# Altium project PCB_Robot_Sumo_2024.PrjPcb
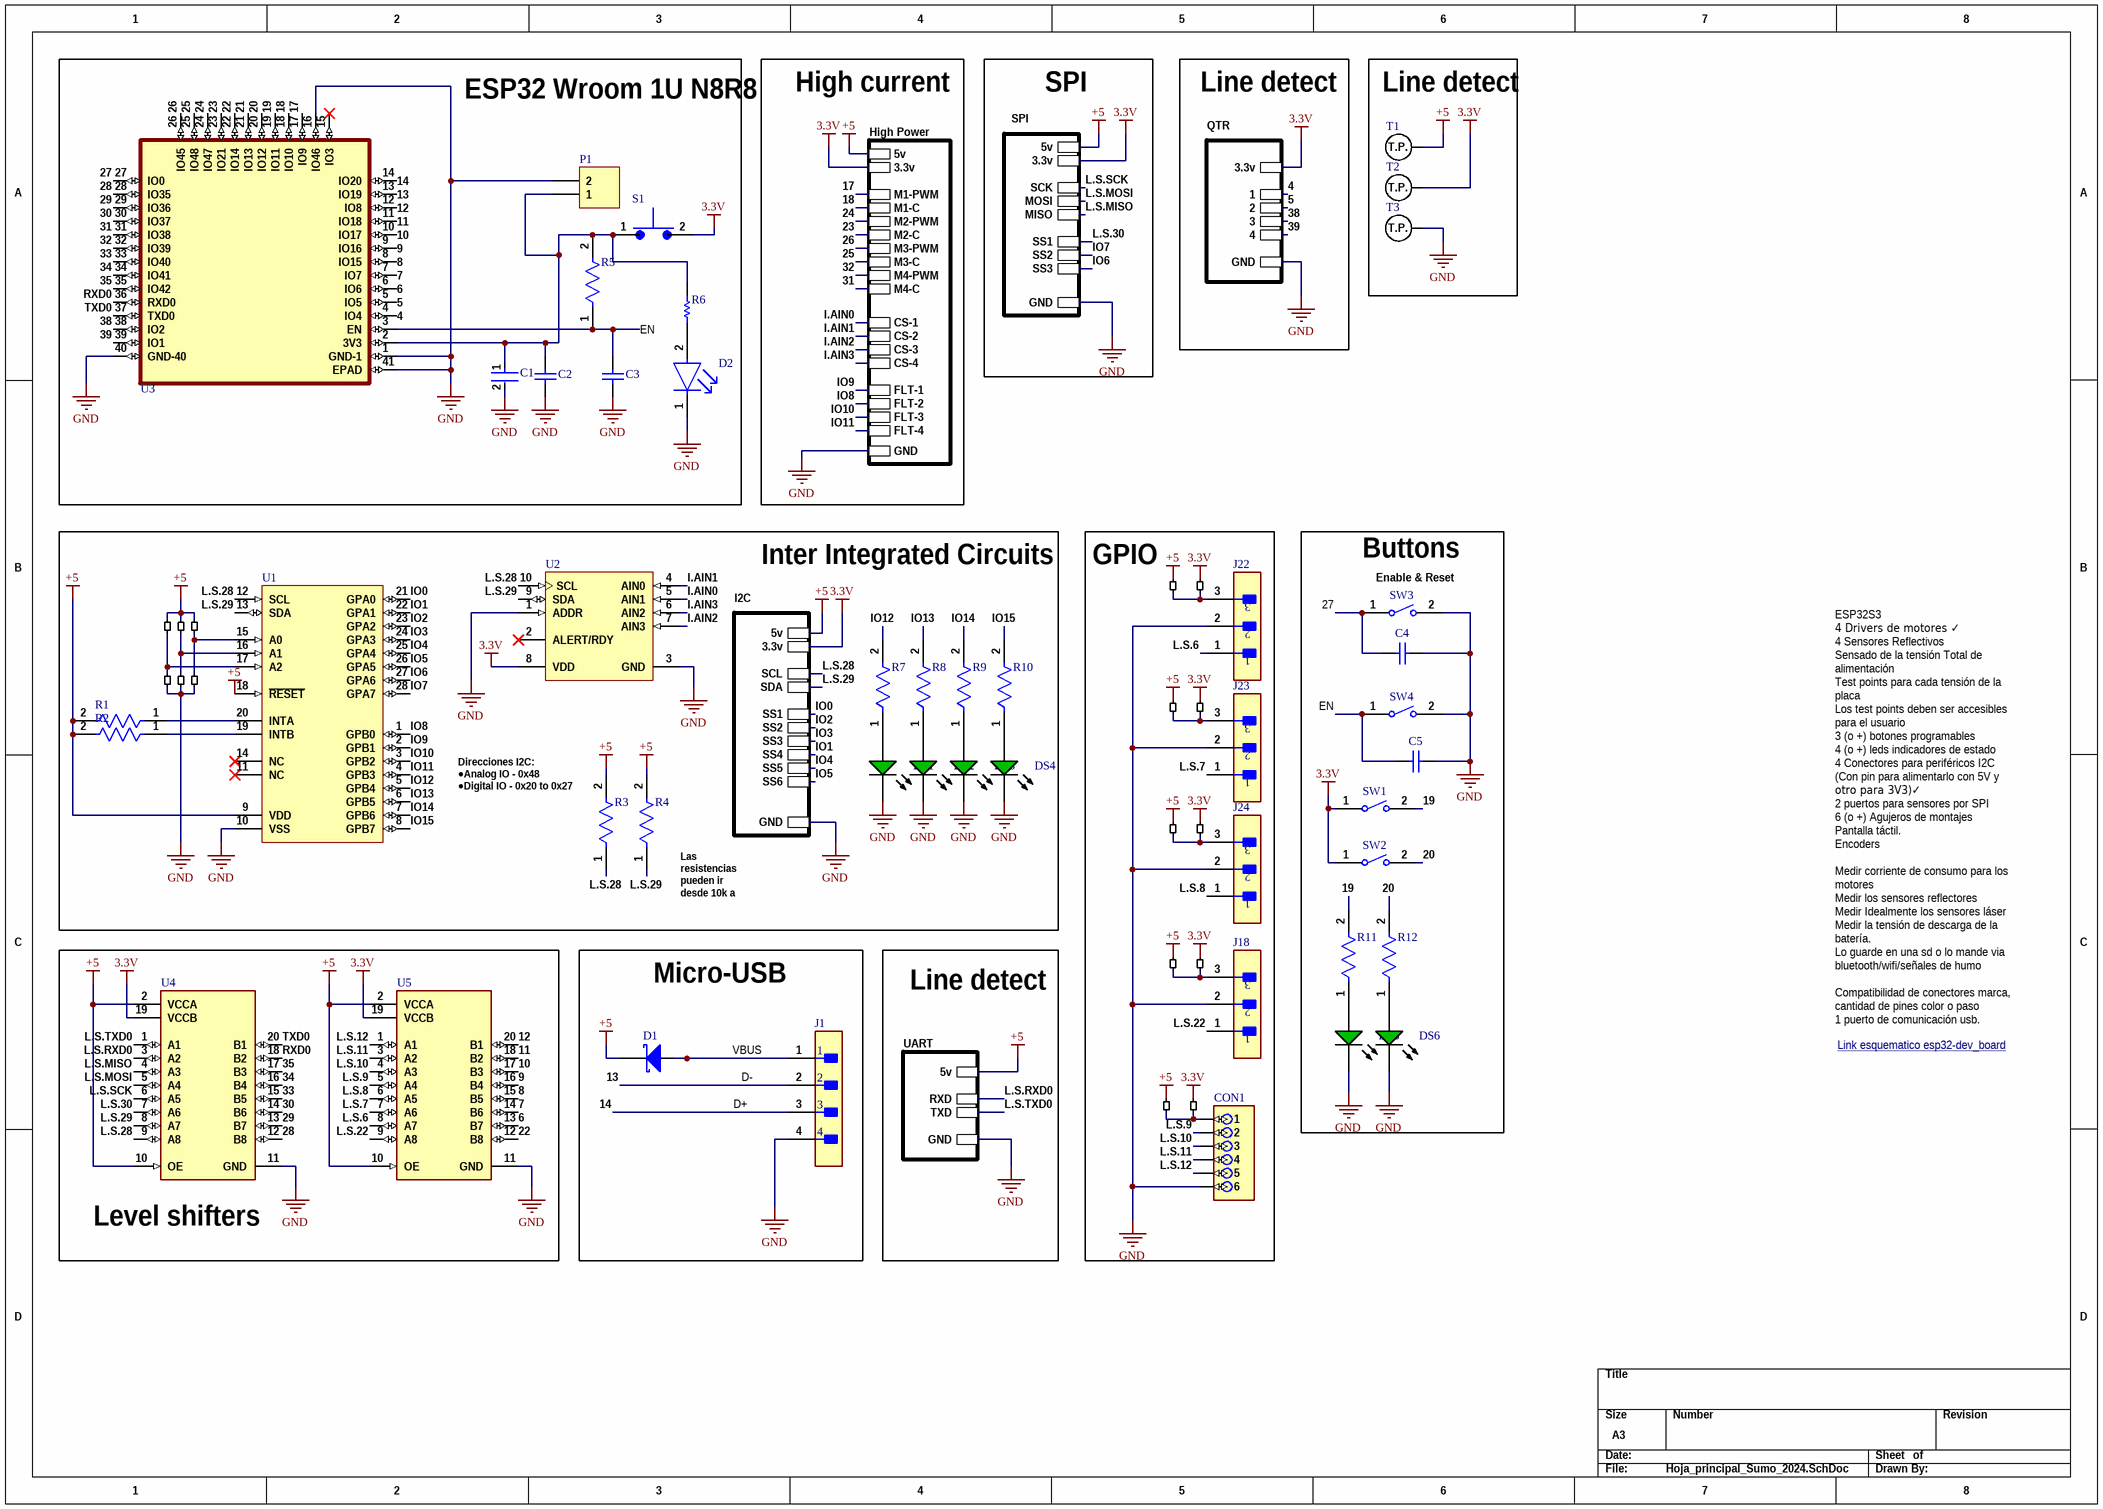
[diagram p0: Hoja_principal_Sumo_2024.SchDoc]
6 sheets, 144 parts. Net scope: hierarchical (ports join the sheet entries above them; power ports are global).
Board file: Brushed_PCB.PcbDoc
Sheets:
  Hoja_principal_Sumo_2024.SchDoc
    I2C = I2C.SchDoc
    QTR = QTR.SchDoc
    SPI = SPI.SchDoc
    UART = UART.SchDoc
    High Power = High_Power.SchDoc

## Sheet Hoja_principal_Sumo_2024.SchDoc: Esquematico Robot Sumo 2024
size A3

### Parts
C1  TMK212BBJ106KG-T  [FP-0805-L_2_0_0_2-W_1_25-MFG]  (value not drawn)
C2  GRM21BR71H104KA01L  [CAPC2013X135X45ML10T25]  (value not drawn)
C3  C0805C105K4PACTU  [CAPC2013X145X50LL20T25]  (value not drawn)
C4  GRM21BR71H104KA01L  [CAPC2013X135X45ML10T25]  (value not drawn)
C5  GRM21BR71H104KA01L  [CAPC2013X135X45ML10T25]  (value not drawn)
CON1  B6B-ZR  [B6B-ZR]  (value not drawn)
D1  BAS3010A03WE6327HTSA1  [INF-SOD323_V]  (value not drawn)
D2  APHCM2012SYCK-F01  [FP-APHCM2012SYCK-F01-MFG]  (value not drawn)
DS1  HSMG-C170  [AVAG-HSMX-C170_V]  (value not drawn)
DS2  HSMG-C170  [AVAG-HSMX-C170_V]  (value not drawn)
DS3  HSMG-C170  [AVAG-HSMX-C170_V]  (value not drawn)
DS4  HSMG-C170  [AVAG-HSMX-C170_V]  (value not drawn)
DS5  HSMG-C170  [AVAG-HSMX-C170_V]  (value not drawn)
DS6  HSMG-C170  [AVAG-HSMX-C170_V]  (value not drawn)
J1  B4B-ZR(LF)(SN)  [FP-B4B-ZR_LF_SN-MFG]  (value not drawn)
J18  B3B-ZR(LF)(SN)  [FP-B3B-ZR_LF_SN-MFG]  (value not drawn)
J22  B3B-ZR(LF)(SN)  [FP-B3B-ZR_LF_SN-MFG]  (value not drawn)
J23  B3B-ZR(LF)(SN)  [FP-B3B-ZR_LF_SN-MFG]  (value not drawn)
J24  B3B-ZR(LF)(SN)  [FP-B3B-ZR_LF_SN-MFG]  (value not drawn)
P1  Header 2  [HDR1X2]  (value not drawn)
R1  CRCW080510K0FKEA  [FP-CRCW0805-e3-IPC_A]  (value not drawn)
R2  CRCW080510K0FKEA  [FP-CRCW0805-e3-IPC_A]  (value not drawn)
R3  CRCW080510K0FKEA  [FP-CRCW0805-e3-IPC_A]  (value not drawn)
R4  CRCW080510K0FKEA  [FP-CRCW0805-e3-IPC_A]  (value not drawn)
R5  CRCW080510K0FKEA  [FP-CRCW0805-e3-IPC_A]  (value not drawn)
R6  CRCW0805680RFKEA  [RESC2013X50X30NL20T20]  (value not drawn)
R7  CRCW0805390RFKEA  [FP-CRCW0805-e3-IPC_B]  (value not drawn)
R8  CRCW0805390RFKEA  [FP-CRCW0805-e3-IPC_B]  (value not drawn)
R9  CRCW0805390RFKEA  [FP-CRCW0805-e3-IPC_B]  (value not drawn)
R10  CRCW0805390RFKEA  [FP-CRCW0805-e3-IPC_B]  (value not drawn)
R11  CRCW0805390RFKEA  [FP-CRCW0805-e3-IPC_B]  (value not drawn)
R12  CRCW0805390RFKEA  [FP-CRCW0805-e3-IPC_B]  (value not drawn)
S1  TS10-63-26-BE-250-SMT-TR  [Switch SMD]  (value not drawn)
SW1  FSMSMTR  [TECO-FSMSMTR_V]  (value not drawn)
SW2  FSMSMTR  [TECO-FSMSMTR_V]  (value not drawn)
SW3  FSMSMTR  [TECO-FSMSMTR_V]  (value not drawn)
SW4  FSMSMTR  [TECO-FSMSMTR_V]  (value not drawn)
T1  Test point  [Testpoint]  (value not drawn)
T2  Test point  [Testpoint]  (value not drawn)
T3  Test point  [Testpoint]  (value not drawn)
U1  MCP23017-E/SS  [SSOP-SS28_L]  (value not drawn)
U2  ADS1115IDGST  [TI-DGS10_N]  (value not drawn)
U3  ESP32-S3-WROOM-1 N8R8  [PCBComponent_1]  (value not drawn)
U4  TXS0108EQPWRQ1  [FP-PW0020A-MFG]  (value not drawn)
U5  TXS0108EQPWRQ1  [FP-PW0020A-MFG]  (value not drawn)
W1  Jumper  [Jumper Mini]  (value not drawn)
W2  Jumper  [Jumper Mini]  (value not drawn)
W3  Jumper  [Jumper Mini]  (value not drawn)
W4  Jumper  [Jumper Mini]  (value not drawn)
W5  Jumper  [Jumper Mini]  (value not drawn)
W6  Jumper  [Jumper Mini]  (value not drawn)
W7  Jumper  [Jumper Mid]  (value not drawn)
W8  Jumper  [Jumper Mid]  (value not drawn)
W9  Jumper  [Jumper Mid]  (value not drawn)
W10  Jumper  [Jumper Mid]  (value not drawn)
W11  Jumper  [Jumper Mid]  (value not drawn)
W12  Jumper  [Jumper Mid]  (value not drawn)
W13  Jumper  [Jumper Mid]  (value not drawn)
W14  Jumper  [Jumper Mid]  (value not drawn)
W27  Jumper  [Jumper Mid]  (value not drawn)
W28  Jumper  [Jumper Mid]  (value not drawn)

### Blocks framed on the sheet
ESP32 Wroom 1U N8R8: C1-C3 D2 P1 R5 R6 S1 U3
Line detect: T1-T3
Inter Integrated Circuits: DS1-DS4 R1-R4 R7-R10 U1 U2 W1-W6
GPIO: CON1 J18 J22-J24 W7-W14 W27 W28
Buttons: C4 C5 DS5 DS6 R11 R12 SW1-SW4
Level shifters: U4 U5
Micro-USB: D1 J1

### Sub-sheets
High Power = High_Power.SchDoc: GND, M1-PWM, M1-C, M2-PWM, M2-C, M3-PWM, M3-C, M4-PWM, M4-C, CS-1, CS-2, CS-3, CS-4, FLT-1, FLT-2, FLT-3, FLT-4, 3.3v, 5v
I2C = I2C.SchDoc: 5v, 3.3v, GND, SCL, SDA, SS1, SS2, SS3, SS4, SS5, SS6
QTR = QTR.SchDoc: 3.3v, GND, 1, 2, 3, 4
SPI = SPI.SchDoc: 5v, 3.3v, GND, MOSI, MISO, SS1, SS2, SS3, SCK
UART = UART.SchDoc: 5v, GND, RXD, TXD

### Nets
3.3V: S1.2 SW1.1 SW2.1 T2.1(T.P.) U2.8(VDD) U4.19(VCCB) U5.19(VCCB) W11.2 W12.2 W13.2 W14.2 W28.2 ; sheet I2C/3.3v, sheet QTR/3.3v, sheet SPI/3.3v, sheet High Power/3.3v
+5: D1.1(K) R1.2 R2.2 R3.2 R4.2 T1.1(T.P.) U1.9(VDD) U1.18(~{RESET}) U4.2(VCCA) U4.10(OE) U5.2(VCCA) U5.10(OE) W1.2 W3.2 W5.2 W7.2 W8.2 W9.2 W10.2 W27.2 ; sheet I2C/5v, sheet SPI/5v, sheet UART/5v, sheet High Power/5v
GND: C1.2 C2.2 C3.1 C4.1 C5.1 CON1.6 D2.1(C) DS1.2(K) DS2.2(K) DS3.2(K) DS4.2(K) DS5.2(K) DS6.2(K) J1.4 J18.2 J22.2 J23.2 J24.2 P1.2 SW3.2 SW4.2 T3.1(T.P.) U1.10(VSS) U2.1(ADDR) U2.3(GND) U3.1(GND-1) U3.16(IO46) U3.40(GND-40) U3.41(EPAD) U4.11(GND) U5.11(GND) W2.1 W4.1 W6.1 ; sheet I2C/GND, sheet QTR/GND, sheet SPI/GND, sheet UART/GND, sheet High Power/GND
4: U3.4(IO4) ; sheet QTR/1
5: U3.5(IO5) ; sheet QTR/2
6: U3.6(IO6) U5.13(B7)
7: U3.7(IO7) U5.14(B6)
8: U3.8(IO15) U5.15(B5)
9: U3.9(IO16) U5.16(B4)
10: U3.10(IO17) U5.17(B3)
11: U3.11(IO18) U5.18(B2)
12: U3.12(IO8) U5.20(B1)
13: J1.2 U3.13(IO19)  [also labelled D-]
14: J1.3 U3.14(IO20)  [also labelled D+]
17: U3.17(IO9) ; sheet High Power/M1-PWM
18: U3.18(IO10) ; sheet High Power/M1-C
19: R11.2 SW1.2 U3.19(IO11)
20: R12.2 SW2.2 U3.20(IO12)
21: U3.21(IO13)
22: U3.22(IO14) U5.12(B8)
23: U3.23(IO21) ; sheet High Power/M2-C
24: U3.24(IO47) ; sheet High Power/M2-PWM
25: U3.25(IO48) ; sheet High Power/M3-C
26: U3.26(IO45) ; sheet High Power/M3-PWM
27: C4.2 SW3.1 U3.27(IO0)
28: U3.28(IO35) U4.12(B8)
29: U3.29(IO36) U4.13(B7)
30: U3.30(IO37) U4.14(B6)
31: U3.31(IO38) ; sheet High Power/M4-C
32: U3.32(IO39) ; sheet High Power/M4-PWM
33: U3.33(IO40) U4.15(B5)
34: U3.34(IO41) U4.16(B4)
35: U3.35(IO42) U4.17(B3)
38: U3.38(IO2) ; sheet QTR/3
39: U3.39(IO1) ; sheet QTR/4
EN: C3.2 C5.2 R5.1 SW4.1 U3.3(EN)
I.AIN0: U2.5(AIN1) ; sheet High Power/CS-1
I.AIN1: U2.4(AIN0) ; sheet High Power/CS-2
I.AIN2: U2.7(AIN3) ; sheet High Power/CS-3
I.AIN3: U2.6(AIN2) ; sheet High Power/CS-4
IO0: U1.21(GPA0) ; sheet I2C/SS1
IO1: U1.22(GPA1) ; sheet I2C/SS4
IO2: U1.23(GPA2) ; sheet I2C/SS2
IO3: U1.24(GPA3) ; sheet I2C/SS3
IO4: U1.25(GPA4) ; sheet I2C/SS5
IO5: U1.26(GPA5) ; sheet I2C/SS6
IO6: U1.27(GPA6) ; sheet SPI/SS3
IO7: U1.28(GPA7) ; sheet SPI/SS2
IO8: U1.1(GPB0) ; sheet High Power/FLT-2
IO9: U1.2(GPB1) ; sheet High Power/FLT-1
IO10: U1.3(GPB2) ; sheet High Power/FLT-3
IO11: U1.4(GPB3) ; sheet High Power/FLT-4
IO12: R7.2 U1.5(GPB4)
IO13: R8.2 U1.6(GPB5)
IO14: R9.2 U1.7(GPB6)
IO15: R10.2 U1.8(GPB7)
L.S.6: J22.1 U5.8(A7)
L.S.7: J23.1 U5.7(A6)
L.S.8: J24.1 U5.6(A5)
L.S.9: CON1.2 U5.5(A4)
L.S.10: CON1.3 U5.4(A3)
L.S.11: CON1.4 U5.3(A2)
L.S.12: CON1.5 U5.1(A1)
L.S.22: J18.1 U5.9(A8)
L.S.28: R3.1 U1.12(SCL) U2.10(SCL) U4.9(A8) ; sheet I2C/SCL
L.S.29: R4.1 U1.13(SDA) U2.9(SDA) U4.8(A7) ; sheet I2C/SDA
L.S.30: U4.7(A6) ; sheet SPI/SS1
L.S.MISO: U4.4(A3) ; sheet SPI/MISO
L.S.MOSI: U4.5(A4) ; sheet SPI/MOSI
L.S.RXD0: U4.3(A2) ; sheet UART/RXD
L.S.SCK: U4.6(A5) ; sheet SPI/SCK
L.S.TXD0: U4.1(A1) ; sheet UART/TXD
RXD0: U3.36(RXD0) U4.18(B2)
TXD0: U3.37(TXD0) U4.20(B1)
VBUS: D1.2(A) J1.1
NetC1_1: C1.1 C2.1 P1.1 R5.2 R6.2 S1.1 U3.2(3V3)
NetCON1_1: CON1.1 W7.1 W11.1
NetD2_2: D2.2(A) R6.1
NetDS1_1: DS1.1(A) R7.1
NetDS2_1: DS2.1(A) R8.1
NetDS3_1: DS3.1(A) R9.1
NetDS4_1: DS4.1(A) R10.1
NetDS5_1: DS5.1(A) R11.1
NetDS6_1: DS6.1(A) R12.1
NetJ18_3: J18.3 W27.1 W28.1
NetJ22_3: J22.3 W8.1 W12.1
NetJ23_3: J23.3 W9.1 W13.1
NetJ24_3: J24.3 W10.1 W14.1
NetR1_1: R1.1 U1.20(INTA)
NetR2_1: R2.1 U1.19(INTB)
NetU1_15: U1.15(A0) W5.1 W6.2
NetU1_16: U1.16(A1) W3.1 W4.2
NetU1_17: U1.17(A2) W1.1 W2.2

Not connected (* = marked no-connect by the designer): U1 11(NC)* 14(NC)*; U2 2(ALERT/RDY)*; U3 15(IO3)*

### Notes on the sheet
- High current
- SPI
- Line detect
- (near SW3) Enable & Reset
- (near R3) Direcciones I2C:
  ●Analog IO - 0x48
  ●Digital IO - 0x20 to 0x27
- (near R4) Las resistencias pueden ir desde 10k a 4k7
- ESP32S3
  4 Drivers de motores ✓
  4 Sensores Reflectivos
  Sensado de la tensión Total de alimentación
  Test points para cada tensión de la placa
  Los test points deben ser accesibles para el usuario
  3 (o +) botones programables
  4 (o +) leds indicadores de estado
  4 Conectores para periféricos I2C (Con pin para alimentarlo con 5V y otro para 3V3)✓
  2 puertos para sensores por SPI
  6 (o +) Agujeros de montajes
  Pantalla táctil.
  Encoders
  Medir corriente de consumo para los motores
  Medir los sensores reflectores
  Medir Idealmente los sensores láser
  Medir la tensión de descarga de la batería.
  Lo guarde en una sd o lo mande via bluetooth/wifi/señales de humo
  Compatibilidad de conectores marca, cantidad de pines color o paso
  1 puerto de comunicación usb.
- Link esquematico esp32-dev_board <https://dl.espressif.com/dl/schematics/SCH_ESP32-S3-DevKitC-1_V1.1_20220413.pdf>

### Library data of the parts
C1 = CMP-14477-000079-3: Multilayer Ceramic Capacitor 10uF 25V X5R 10% SMD 0805 T/R; Voltage: 16V; Dielectric: X7R; Number of Pins: 2; Width: 0.049inch; REACH SVHC: No SVHC; Packaging: Tape and Reel; Max Operating Temperature: 85°C; Length: 0.079inch; Termination: SMD/SMT; RoHS Compliant: Yes; Thickness: 0.053inch; Case/Package: 0805; Case Code (Imperial): 0805; Capacitance: 10uF; Lead Free: Lead Free; Voltage Rating: 25V; Resistor Type: Ceramic; Voltage Rating (DC): 25V; Case Code (Metric): 2012; Mount: Surface Mount; Package Quantity: 1; Height: 1.25mm; Series: M; Tolerance: 10%; Min Operating Temperature: -55°C
C2 C4 C5 = CMP-2100-03644-1: Chip Capacitor, 0.1 uF, +/- 10%, 50 V, -55 to 125 degC, 0805 (2012 Metric), RoHS, Tape and Reel; Manufacturer: Murata; Voltage: 50V; Capacitance: 100nF; Insulation Resistance: 10GR; Dielectric Material: Ceramic; Dielectric: X7R; Package Description: 2-Pin Surface Mount Device, Body 2 x 1.25 mm; Manufacturer URL: http://www.murata.com/; Case Code (Imperial): 0805; Datasheet URL: http://psearch.en.murata.com/capacitor/product/GRM21BR71H104KA01%23.pdf; Termination: SMD/SMT; Lead Free: LeadFree; Package Quantity: 1; Mount: SurfaceMount; REACH SVHC: Unknown; Thickness: 0.053inch; Height: 1.25mm; Case/Package: 0805; Voltage Rating: 50V; Width: 0.049inch; Case Code (Metric): 2012; Material: Ceramic; Min Operating Temperature: -55degC; RoHSCompliant: true; Datasheet Version: 42675.0; Voltage Rating (DC): 50V; Tolerance: 10%; Package Reference: 0805; Depth: 1.25mm; Length: 2mm; Max Operating Temperature: 125degC; Packaging: TapeandReel; Number of Pins: 2; Radiation Hardening: No
C3 = CMP-1036-04746-2: Manufacturer: Kemet; Part Number: C0805C105K4PACTU
CON1 = B6B-ZR: Connector Header Surface Mount 6 position 0.059 (1.50mm); MF: JST; Package: None; MP: B6B-ZR; Price: None; Availability: Unavailable; Check_prices: https://www.snapeda.com/parts/B6B-ZR/JST/view-part/4701794/?ref=eda; Value: *; SnapEDA_Link: https://www.snapeda.com/parts/B6B-ZR/JST/view-part/4701794/?ref=snap
D1 = CMP-2000-05919-1: Medium Power AF Schottky Diode, 0.41 V, 1 A, -65 to 125 degC, 2-Pin SOD323, RoHS, Tape and Reel; Manufacturer: Infineon; Lead Finish: Tin; Peak Average Forward Current: 1A; Peak Reverse Repetitive Voltage: 30V; Max Processing Temp: 260; Configuration: Single; Screening Level: Automotive; Package Reference: SOD323; Package Description: 2-Pin Small Outline Diode Package, Body 1.25 x 1.7 mm; Manufacturer URL: http://www.infineon.com/; Mounting: SurfaceMount; Mounting Technology: SurfaceMount; Datasheet URL: http://www.infineon.com/dgdl/Infineon-BAS3010ASERIES-DS-v01_01-en.pdf?fileId=db3a30431ddc9372011dfbc50f231c06; Type: SchottkyDiode; Datasheet Version: 04/2007; Operating Temperature: -65to125C; Package URL: http://www.infineon.com/dgdl/SOD323-Package_Overview.pdf?folderId=db3a30431936bc4b011952aab84f3bbe&fileId=db3a30431936bc4b011952beed653be3
D2 = CMP-44529-000064-1: LED YELLOW CLEAR CHIP SMD; Number of LEDs: 1; Luminous Intensity: 150mcd; Dominant Wavelength: 590nm; Test Current: 20mA; Illumination Color: Green; Forward Voltage: 2V; Viewing Angle: 110°; Number of Pins: 2; Packaging: Tape and Reel; Width: 1.25mm; Height: 0.4mm; Lens Color: Clear; RoHS Compliant: Yes; Lead Free: Lead Free; Min Operating Temperature: -40°C; Case Code (Imperial): 0805; Case/Package: 0805; Series: APHCM; Wavelength: 590nm; Max Operating Temperature: 85°C; Length: 2mm; Color: Yellow; Package Quantity: 2000; Mount: Surface Mount; Lens Style: Clear; Forward Current: 20mA; Case Code (Metric): 2012
DS1-DS6 = CMP-2000-05062-1: Chip LED, Green, 2.2 V, -40 to 85 degC, 2-Pin SMD, Pb-Free, Tape and Reel; Manufacturer: Avago; No. of Pins: 2; Peak Wavelength: 570nm; SVHC: NoSVHC(16-Jun-2014); Dominant Wavelength: 572nm; Forward Current If: 20mA; Viewing Angle: 170deg; Lens Shape: Rectangular; PIV Max: 5V; External Width: 1.25mm; LED Type: Standard; External Depth: 0.8mm; Opto Mounting Orientation: Top; Luminous Intensity: 15mcd; Luminous Intensity Min: 4mcd; Forward Voltage VF Max: 2.6V; External Length / Height: 2mm; Bulb Size: 1.25mmx1.4mm; Light Area Height: 1mm; Voltage Vf Typ: 2.2V; Operating Temperature Max: 85degC; Datasheet Version: Oct-08; MSL: MSL2A-4weeks; Peak Forward Current: 20mA; Package Description: 2-Pin Surface Mount Device, Body 2 x 1.25 mm, Height 0.8 mm; Datasheet URL: https://datasheet.ciiva.com/29280/180495-da-01-en-chip-led-hsmg-c170-gelb-gruen-29280971.pdf; Storage Temperature Min: -40degC; LED Colour: Green; Wavelength Typ: 570nm; Mounting Type: SMD; Forward Current If Max: 20mA; Dominant Wavelength Typ: 572nm; LED Mounting: SMD; Operating Temperature Range: -30degCto+85degC; Operating Temperature Min: -30degC; Manufacturer URL: http://www.avagotech.com/; Packaging: CutTape; Luminous Intensity Typ: 15mcd; Package Reference: HSMX-C170; Storage Temperature Max: 85degC; Opto Case Style: SMD; Forward Voltage: 2.2V
J1 = CMP-17439-000033-1: CONN HEADER VERT 4POS 1.5MM; Max Current Rating: 1A; Max Voltage Rating (AC): 50V; Contact Resistance: 30mR; Body Plating: Tin; Number of Positions: 4; Connector Type: Male Pin; Panel Thickness: 3.5mm; Gender: Male; Insulation Resistance: 500MR; Termination: Solder; Fastening Type: Detent; Housing Material: Polyamide; Voltage Rating (DC): 50V; REACH SVHC: No SVHC; Lead Free: Lead Free; Min Operating Temperature: -25°C; Depth: 3.5mm; Contact Mating Length: 0.094inch; Material: Nylon; Max Operating Temperature: 85°C; Mount: Through Hole; Number of Rows: 1; Orientation: Straight; Current Rating: 1A; Flammability Rating: UL94 V-0; Housing Color: Beige; Length: 7.5mm; Packaging: Bulk; Voltage Rating: 50V; Voltage Rating (AC): 50V; Number of Contacts: 4; Lead Pitch: 1.5mm; Series: ZH; Color: Natural; Contact Plating: Tin; Pitch: 1.5mm; Contact Type: Male Pin; Contact Material: Brass
J18 J22-J24 = CMP-17439-000041-1: CONN HEADER VERT 3POS 1.5MM; Gender: Male; Max Voltage Rating (AC): 50V; Body Plating: Tin; Panel Thickness: 3.5mm; Number of Contacts: 3; Connector Type: Male Pin; Max Current Rating: 1A; Insulation Resistance: 500MR; Contact Resistance: 30mR; Pitch: 1.5mm; Lead Pitch: 1.5mm; Termination: Solder; Material: Nylon; Depth: 3.5mm; Min Operating Temperature: -25°C; Voltage Rating (DC): 50V; Number of Positions: 3; Voltage Rating (AC): 50V; Contact Plating: Tin; Housing Material: Polyamide; Mount: Through Hole; Number of Rows: 1; Series: ZH; Lead Free: Lead Free; Flammability Rating: UL94 V-0; Housing Color: Beige; REACH SVHC: No SVHC; Current Rating: 1A; Contact Type: Male Pin; Orientation: Straight; Voltage Rating: 50V; Packaging: Bulk; Color: Natural; Length: 6mm; Contact Material: Copper; Max Operating Temperature: 85°C; Fastening Type: Detent; Contact Mating Length: 0.094inch
P1 = Header 2: Header, 2-Pin; LatestRevisionDate: 17-Jul-2002; LatestRevisionNote: Re-released for DXP Platform.; Publisher: Altium Limited
R1-R5 = CMP-2001-04908-2: RES Thick Film, 10kΩ, 1%, 0.125W, 100ppm/°C, 0805; Resistance: 10kR; Voltage Rating (DC): 150V; Power Rating: 125mW; Weight: 0.000194oz; Package Quantity: 5000; Military Standard: Not; Max Operating Temperature: 155°C; Temperature Coefficient: 100ppm/°C; Contact Plating: Tin; Width: 1.25mm; Height: 0.45mm; Radiation Hardening: No; Tolerance: 1%; Min Operating Temperature: -55°C; Voltage Rating: 150V; Length: 2mm; Depth: 1.25mm; Termination: SMD/SMT; Packaging: Tape and Reel; Case/Package: 0805; Case Code (Metric): 2012; Lead Free: Lead Free; Case Code (Imperial): 0805; Composition: Thick Film
R6 = CMP-2001-04066-1: Manufacturer: Vishay Dale; Part Number: CRCW0805680RFKEA
R7-R12 = CMP-2001-03859-2: RES Thick Film, 390Ω, 1%, 0.125W, 100ppm/°C, 0805; Power Rating: 125mW; Voltage Rating: 150V; Resistance: 390R; Temperature Coefficient: 100ppm/°C; Max Operating Temperature: 155°C; Case Code (Imperial): 0805; Package Quantity: 10; Case Code (Metric): 2012; Weight: 0.000194oz; Case/Package: 0805; Depth: 1.25mm; Tolerance: 1%; Number of Terminations: 2; Min Operating Temperature: -55°C; Composition: Thick Film; Packaging: Tape and Reel; Features: Automotive AEC-Q200; Contact Plating: Tin; Radiation Hardening: No; Mount: Surface Mount; Length: 2mm; Military Standard: Not; Voltage Rating (DC): 150V; Termination: SMD/SMT; Max Power Dissipation: 125mW; Width: 0.049inch; Lead Free: Lead Free; Height: 0.45mm
SW1-SW4 = CMP-2000-07501-1: FSMSM Push Button Switch, 50 mA, -35 to 85 degC, 2-Pin SMD, RoHS, Tape and Reel; Manufacturer: TE Connectivity; Voltage Rating (DC): 24V; Electrical Life: 20000Cycles; Operating Force: 180gf; Switch Travel: 0.25mm; Contact Current Rating: 50mA; Case\/Package: SMD/SMT; Actuator Length: 1.07mm; Throw Configuration: SPST; Actuator Material: Polyamide; Contact Resistance: 100mOhm; Illumination Type: Illuminated; Max Voltage Rating (DC): 12V; Manufacturer URL: http://www.te.com/; Lead Free: LeadFree; Packaging: TapeandReel; Min Operating Temperature: -35degC; Mechanical Life: 20000Cycles; Mount: SurfaceMount; REACH SVHC: Unknown; Package Quantity: 1800; Package Reference: FSMSMTR; RoHSCompliant: true; Max Operating Temperature: 85degC; Orientation: Straight; ELV: Compliant; Datasheet URL: http://www.te.com/commerce/DocumentDelivery/DDEController?Action=showdoc&DocId=Customer+Drawing%7F1437566-3%7FC2%7Fpdf%7FEnglish%7FENG_CD_1437566-3_C2_1437566_3_1_c.dwg.pdf%7F1437566-4; Package Description: 2-Pin Surface Mount Device, Body 6 x 3.5 mm, Pitch 9.19 mm; Current Rating: 50mA; Contact Plating: Silver; Termination: GullWing; Datasheet Version: Rev. C2, 08/2014; Contact Material: Brass; Mounting Technology: SurfaceMount
U1 = CMP-0186-00176-2: 16-Bit I/O Expander with Serial Interface, 28-Pin SSOP, Extended Temperature; PackageVersion: revBB, Aug-2009; ComponentLink1Description: Manufacturer URL; ComponentLink3Description: Package Specification; PackageDescription: 28-Lead Plastic Shrink Small Outline (SS) - 5.3mm Body [SSOP]; ComponentLink1URL: http://www.microchip.com/; Code_JEDEC: MS-150; RevisionNote: URLs added.; ComponentLink3URL: http://www.microchip.com/stellent/groups/techpub_sg/documents/packagingspec/en012702.pdf; ComponentLink2URL: http://ww1.microchip.com/downloads/en/DeviceDoc/21952b.pdf; ComponentLink2Description: Datasheet; PackageReference: SSOP-SS28; DatasheetVersion: revB, Feb-2007
U2 = CMP-0003-00378-2: 16-Bit ADC with Integrated Multiplexer, PGA, Comparator, Oscillator, and Reference, -40 to 125 degC, 10-pin SOP (DGS10), Green (RoHS & no Sb/Br); Manufacturer: Texas Instruments; Sample Rate (max)(SPS): 860; SubFamily: Precision ADC (<=10MSPS); Architecture: Delta-Sigma; Digital Supply(Min)(V): 2; Resolution(Bits): 16; Digital Supply(Max)(V): 5.5; INL(Max)(+/-LSB): 1; Interface: Serial I2C; # Input Channels: 4; Eco-Plan: Green (RoHS & no Sb/Br); PackageDescription: 10-Pin Plastic Small Outline, Body 3 x 3 mm, Pitch 0.5 mm; Mounting Technology: Surface Mount; PackageReference: DGS10; DatasheetVersion: SBAS444B; ComponentLink3Description: Package Specification; ComponentLink1Description: Manufacturer URL; PartNumber: ADS1115IDGST; ComponentLink3URL: http://www.ti.com/lit/ml/mpds035b/mpds035b.pdf; ComponentLink2URL: http://www.ti.com/general/docs/lit/getliterature.tsp?genericPartNumber=ADS1115&fileType=pdf; Analog Voltage AV/DD(Min)(V): 2; ComponentLink2Description: Datasheet; PackageVersion: 4073272/C, 02/2004; Analog Voltage AV/DD(Max)(V): 5.5; Code_JEDEC: MO-153; ComponentLink1URL: http://www.ti.com/
U3 = ESP32-S3-WROOM-1: SMD MODULE, ESP32-S3R8 WITH 8 MB; MF: Espressif Systems; SnapEDA_Link: https://www.snapeda.com/parts/ESP32-S3-WROOM-1/Espressif+Systems/view-part/?ref=snap; Package: NON STANDARD Espressif Systems; Value: *; MP: ESP32-S3-WROOM-1; Check_prices: https://www.snapeda.com/parts/ESP32-S3-WROOM-1/Espressif+Systems/view-part/?ref=eda; Supplier 1: Digikey
U4 U5 = CMP-04899-000001-1: IC TRNSLTR BIDIRECTIONAL 20TSSOP; Manufacturer: Texas Instruments; Standoff Height: 0.05mm; Number Of Circuits: 1; V A Max: 3.6V; Automotive Grade: Grade 1; Number Of Inputs: 8; Max Junction Temp: +150°C; V A Min: 1.4V; Nominal Supply Current: 8uA; Logic Function Desc: Non-inverting; V B Max: 5.5V; V B Min: 1.65V; Data Rate: 110Mbits/s; Ambient Temperature Range High: +125°C; Height: 1.2mm; Temperature Range High: +125°C; ComponentLink2Description: Datasheet; Manufacturer Part Number: TXS0108EQPWRQ1; Digikey Description: IC TRNSLTR BIDIRECTIONAL 20TSSOP; Lead Free: Yes; Automotive: Yes; Number Of Outputs: 8; Temperature Range Low: -40°C; Mouser Description: Translation - Voltage Levels 8B Bidir Vltg-Level Translator ALT 595-TXS0108EPWR; Ambient Temperature Range Low: -40°C; ComponentLink2URL: http://www.ti.com/lit/ds/symlink/txs0108e-q1.pdf; Device Class L2: Logic ICs; Min Supply Voltage: 1.4V; Device Class L1: Integrated Circuits (ICs); Octopart: https://octopart.com/txs0108eqpwrq1-texas+instruments-59160487; Temperature: -40°C to +125°C; Package: PW0020A; RoHS: TRUE; Ipc Land Pattern Name: SOP65P640X120-20; Device Class L3: Voltage Level Shifters; Max Supply Voltage: 5.5V; Category: IC
S1 = TS10-63-26-BE-250-SMT-TR: Value: *; Package: None; Price: None; MP: TS10-63-26-BE-250-SMT-TR; Availability: Unavailable; Supplier 1: Digikey; Supplier Part Number 1: 2223-TS10-63-26-BE-250-SMT-TRCT-ND

## Sheet I2C.SchDoc
size A4
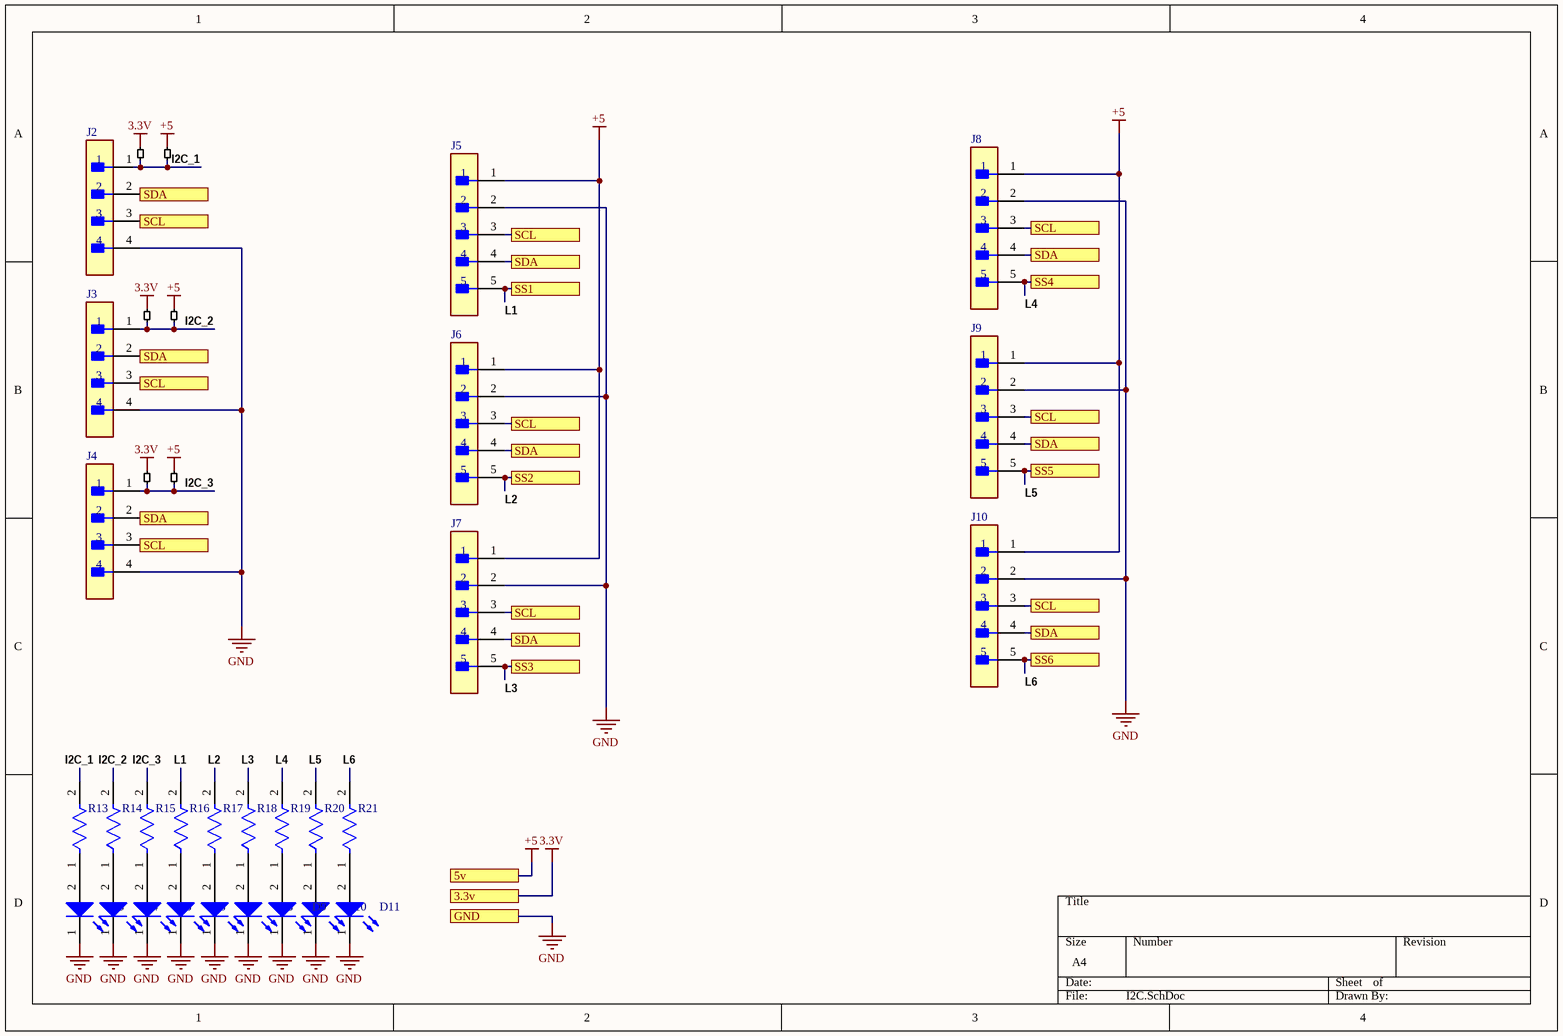
[diagram p1: I2C.SchDoc]

### Parts
D3  150080BS75000  [WL-SMCW_0805_150080xx75000]  (value not drawn)
D4  150080BS75000  [WL-SMCW_0805_150080xx75000]  (value not drawn)
D5  150080BS75000  [WL-SMCW_0805_150080xx75000]  (value not drawn)
D6  150080BS75000  [WL-SMCW_0805_150080xx75000]  (value not drawn)
D7  150080BS75000  [WL-SMCW_0805_150080xx75000]  (value not drawn)
D8  150080BS75000  [WL-SMCW_0805_150080xx75000]  (value not drawn)
D9  150080BS75000  [WL-SMCW_0805_150080xx75000]  (value not drawn)
D10  150080BS75000  [WL-SMCW_0805_150080xx75000]  (value not drawn)
D11  150080BS75000  [WL-SMCW_0805_150080xx75000]  (value not drawn)
J2  B4B-XH-A(LF)(SN)  [FP-B4B-XH-A_LF_SN-MFG]  (value not drawn)
J3  B4B-XH-A(LF)(SN)  [FP-B4B-XH-A_LF_SN-MFG]  (value not drawn)
J4  B4B-XH-A(LF)(SN)  [FP-B4B-XH-A_LF_SN-MFG]  (value not drawn)
J5  B5B-PH-K-S(LF)(SN)  [FP-B5B-PH-K-S_LF_SN-MFG]  (value not drawn)
J6  B5B-PH-K-S(LF)(SN)  [FP-B5B-PH-K-S_LF_SN-MFG]  (value not drawn)
J7  B5B-PH-K-S(LF)(SN)  [FP-B5B-PH-K-S_LF_SN-MFG]  (value not drawn)
J8  B5B-PH-K-S(LF)(SN)  [FP-B5B-PH-K-S_LF_SN-MFG]  (value not drawn)
J9  B5B-PH-K-S(LF)(SN)  [FP-B5B-PH-K-S_LF_SN-MFG]  (value not drawn)
J10  B5B-PH-K-S(LF)(SN)  [FP-B5B-PH-K-S_LF_SN-MFG]  (value not drawn)
R13  ERJ-P06F1001V  [FP-ERJP06-IPC_C]  (value not drawn)
R14  ERJ-P06F1001V  [FP-ERJP06-IPC_C]  (value not drawn)
R15  ERJ-P06F1001V  [FP-ERJP06-IPC_C]  (value not drawn)
R16  ERJ-P06F1001V  [FP-ERJP06-IPC_C]  (value not drawn)
R17  ERJ-P06F1001V  [FP-ERJP06-IPC_C]  (value not drawn)
R18  ERJ-P06F1001V  [FP-ERJP06-IPC_C]  (value not drawn)
R19  ERJ-P06F1001V  [FP-ERJP06-IPC_C]  (value not drawn)
R20  ERJ-P06F1001V  [FP-ERJP06-IPC_C]  (value not drawn)
R21  ERJ-P06F1001V  [FP-ERJP06-IPC_C]  (value not drawn)
W15  Jumper  [Jumper Mid]  (value not drawn)
W16  Jumper  [Jumper Mid]  (value not drawn)
W17  Jumper  [Jumper Mid]  (value not drawn)
W18  Jumper  [Jumper Mid]  (value not drawn)
W19  Jumper  [Jumper Mid]  (value not drawn)
W20  Jumper  [Jumper Mid]  (value not drawn)

### Ports
3.3v, 5v, GND, SCL, SDA, SS1, SS2, SS3, SS4, SS5, SS6

### Nets
3.3V: W15.2 W16.2 W17.2 ; port 3.3v
+5: J5.1 J6.1 J7.1 J8.1 J9.1 J10.1 W18.2 W19.2 W20.2 ; port 5v
GND: D3.1(K) D4.1(K) D5.1(K) D6.1(K) D7.1(K) D8.1(K) D9.1(K) D10.1(K) D11.1(K) J2.4 J3.4 J4.4 J5.2 J6.2 J7.2 J8.2 J9.2 J10.2 ; port GND
I2C_1: J2.1 R13.2 W15.1 W18.1
I2C_2: J3.1 R14.2 W16.1 W19.1
I2C_3: J4.1 R15.2 W17.1 W20.1
L1: J5.5 R16.2 ; port SS1  [project net IO0]
L2: J6.5 R17.2 ; port SS2  [project net IO2]
L3: J7.5 R18.2 ; port SS3  [project net IO3]
L4: J8.5 R19.2 ; port SS4  [project net IO1]
L5: J9.5 R20.2 ; port SS5  [project net IO4]
L6: J10.5 R21.2 ; port SS6  [project net IO5]
L.S.28: J2.3 J3.3 J4.3 J5.3 J6.3 J7.3 J8.3 J9.3 J10.3 ; port SCL
L.S.29: J2.2 J3.2 J4.2 J5.4 J6.4 J7.4 J8.4 J9.4 J10.4 ; port SDA
NetD3_2: D3.2(A) R13.1
NetD4_2: D4.2(A) R14.1
NetD5_2: D5.2(A) R15.1
NetD6_2: D6.2(A) R16.1
NetD7_2: D7.2(A) R17.1
NetD8_2: D8.2(A) R18.1
NetD9_2: D9.2(A) R19.1
NetD10_2: D10.2(A) R20.1
NetD11_2: D11.2(A) R21.1

### Library data of the parts
D3-D11 = CMP-1426-00008-6: NexarPartId: 29717779; Test Current: 20mA; Lens Style: Clear, Rectangular; Forward Current: 100mA; Power Dissipation: 105mW; Dominant Wavelength: 470nm; Reverse Voltage: 5V; Viewing Angle: 140°; Luminous Intensity: 145mcd; Color: Blue; Forward Voltage: 3.2V; Max Junction Temperature (Tj): 95°C; Peak Wavelength: 465nm; Min Operating Temperature: -40°C; Mount: Surface Mount; Case Code (Imperial): 0805; Packaging: Tape and Reel; Lead Free: Lead Free; Length: 2mm; Case/Package: 0805; Case Code (Metric): 2012; Max Operating Temperature: 85°C; Height: 700µm; RoHS: Compliant; Max Reverse Voltage (DC): 5V; REACH SVHC: Unknown; Width: 1.25mm; Wavelength: 470nm
J2-J4 = CMP-17439-000250-1: CONN HEADER VERT 4POS 2.5MM; Number of Contacts: 4; Contact Resistance: 20mR; Voltage Rating: 250V; Max Current Rating: 3A; Gender: Male; Wire/Cable Gauge: 22AWG; Mated Stacking Heights: 9.8mm; Insulation Resistance: 1GR; Orientation: Straight; Contact Type: Male Pin; Contact Finish - Mating: TIN; Series: XH; Max Voltage Rating (AC): 250V; Lead Pitch: 2.5mm; Contact Shape: Square; Insulation Color: Natural; Termination: Solder; Lead Free: Lead Free; Voltage Rating (AC): 250V; Number of Rows: 1; Flammability Rating: UL94 V-0; Number of Positions: 4; Max Operating Temperature: 85°C; Package Quantity: 500; Mount: Through Hole; REACH SVHC: No SVHC; Connector Type: Header; Insulation Material: Nylon; Fastening Type: Detent; Min Operating Temperature: -25°C; Housing Color: White; Packaging: Bulk; Contact Plating: Tin; Contact Material: Brass; Max Voltage Rating (DC): 250V; Housing Material: Polyamide; Color: Natural; Material: Polyamide; Pitch: 2.5mm; Depth: 5.75mm; Current Rating: 3A; Length: 12.4mm
J5-J10 = CMP-2000-05908-2: CONN HEADER VERT 5POS 2MM; Voltage Rating (AC): 100V; Number of Positions: 5; Contact Resistance: 20mR; Insulation Resistance: 1MR; Current Rating: 2A; Gender: Male; Mated Stacking Heights: 8mm; Series: PH; Number of Poles: 5; Width: 4.5mm; Insulation Color: Natural; Fastening Type: Detent; Flammability Rating: UL94 V-0; Mount: Through Hole; Lead Free: Lead Free; Number of Rows: 1; REACH SVHC: No SVHC; Max Voltage Rating (AC): 100V; Contact Mating Length: 0.13inch; Contact Plating: Tin; Housing Material: Polyamide; Depth: 4.5mm; Contact Type: Male Pin; Voltage Rating: 100V; Color: Natural; Housing Color: White; Lead Pitch: 2mm; Number of Contacts: 5; Orientation: Straight; Packaging: Bulk; Contact Material: Brass; Pitch: 2mm; Insulation Material: Nylon; Connector Type: Header; Contact Finish - Mating: TIN; Termination: Solder; Number of Pins: 5; Length: 11.9mm; Contact Shape: Square; Max Current Rating: 2A; Working Voltage: 100V; Min Operating Temperature: -25°C; Max Operating Temperature: 85°C; Material: Polyamide; Height: 9.4mm
R13-R21 = CMP-05422-000125-1: RES SMD 1K OHM 1% 1/2W 0805; Temperature Coefficient: 100ppm/°C; Max Power Dissipation: 500mW; Voltage Rating: 150V; Resistance: 1kR; Case Code (Metric): 2012; Max Operating Temperature: 155°C; REACH SVHC: No SVHC; Mount: Surface Mount; Military Standard: Not; Package Quantity: 5000; Series: ERJ; Height: 0.6mm; Radiation Hardening: No; Termination: Tab; Number of Terminations: 2; Length: 2mm; Resistance Tolerance: 1%; Voltage Rating (DC): 150V; Depth: 1.25mm; Construction: Rectangular; Resistor Type: Thick Film; Packaging: Tape and Reel; Contact Plating: Tin; RoHS Compliant: Yes; Features: Automotive AEC-Q200; Number of Pins: 2; Case Code (Imperial): 0805; Technology: THICK FILM; Width: 1.2mm; Case/Package: 0805; Min Operating Temperature: -55°C; Power Rating: 500mW; Tolerance: 1%

## Sheet QTR.SchDoc
size A4
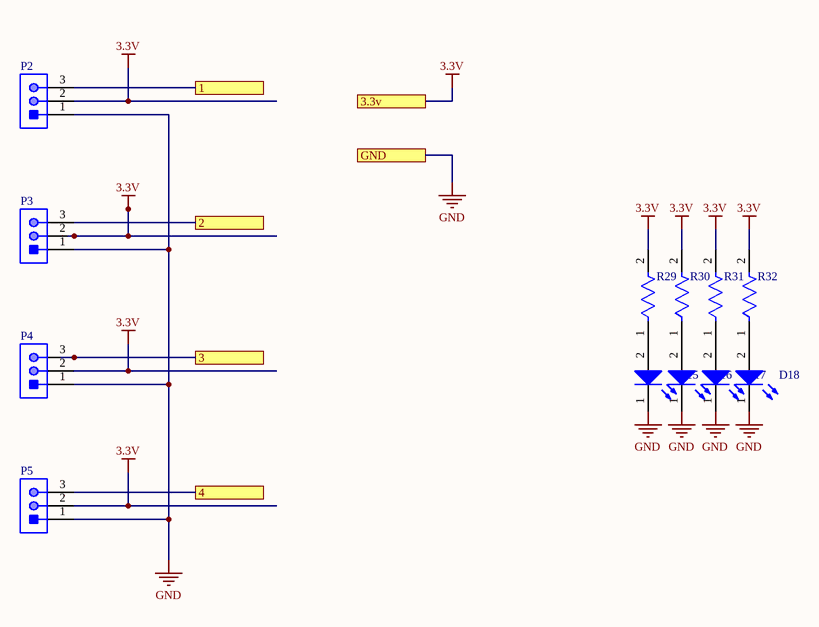
[diagram p2: QTR.SchDoc]

### Parts
D15  150080BS75000  [WL-SMCW_0805_150080xx75000]  (value not drawn)
D16  150080BS75000  [WL-SMCW_0805_150080xx75000]  (value not drawn)
D17  150080BS75000  [WL-SMCW_0805_150080xx75000]  (value not drawn)
D18  150080BS75000  [WL-SMCW_0805_150080xx75000]  (value not drawn)
P2  B3B-PH-K-S(LF)(SN)  [JST-B3B-PH-K-S-3_V]  (value not drawn)
P3  B3B-PH-K-S(LF)(SN)  [JST-B3B-PH-K-S-3_V]  (value not drawn)
P4  B3B-PH-K-S(LF)(SN)  [JST-B3B-PH-K-S-3_V]  (value not drawn)
P5  B3B-PH-K-S(LF)(SN)  [JST-B3B-PH-K-S-3_V]  (value not drawn)
R29  ERJ-6ENF1500V  [FP-ERJ6EN-IPC_A]  (value not drawn)
R30  ERJ-6ENF1500V  [FP-ERJ6EN-IPC_A]  (value not drawn)
R31  ERJ-6ENF1500V  [FP-ERJ6EN-IPC_A]  (value not drawn)
R32  ERJ-6ENF1500V  [FP-ERJ6EN-IPC_A]  (value not drawn)

### Ports
1, 2, 3, 3.3v, 4, GND

### Nets
3.3V: P2.2 P3.2 P4.2 P5.2 R29.2 R30.2 R31.2 R32.2 ; port 3.3v
GND: D15.1(K) D16.1(K) D17.1(K) D18.1(K) P2.1 P3.1 P4.1 P5.1 ; port GND
4: P2.3 ; port 1
5: P3.3 ; port 2
38: P4.3 ; port 3
39: P5.3 ; port 4
NetD15_2: D15.2(A) R29.1
NetD16_2: D16.2(A) R30.1
NetD17_2: D17.2(A) R31.1
NetD18_2: D18.2(A) R32.1

### Library data of the parts
D15-D18 = CMP-1426-00008-6: as D3 on sheet I2C; Min Operating Temperature: -40°C; Mount: Surface Mount; Case Code (Imperial): 0805; Packaging: Tape and Reel; Lead Free: Lead Free; Length: 2mm; Case/Package: 0805; Case Code (Metric): 2012; Max Operating Temperature: 85°C; Height: 700µm; RoHS: Compliant; Max Reverse Voltage (DC): 5V; REACH SVHC: Unknown; Width: 1.25mm; Wavelength: 470nm
P2-P5 = CMP-2000-05164-1: Male Header, Pitch 2 mm, 1 x 3 Position, Height 6 mm, Tail Length 3.4 mm, -25 to 85 degC, RoHS, Bulk; Manufacturer: JST; Style/Orientation: StraightHeader/Plug; Pitch: 2mm; No of Positions: 3; Termination: Crimp; Manufacturer URL: http://www.jst.com/home2.html; Datasheet Version: Oct-06; Type: ShroudedHeader; Datasheet URL: https://datasheet.ciiva.com/11746/0900766b80826550-11746939.pdf
R29-R32 = CMP-2001-04437-2: NexarPartId: 55422415; Power Rating: 125mW; Temperature Coefficient: 100ppm/°C; Tolerance: 1%; Working Voltage: 150V; Resistance: 150Ω; Max Power Dissipation: 125mW; Composition: Thick Film; Case Code (Metric): 2012; Depth: 1.25mm; Radiation Hardening: No; Height: 600µm; Lead Free: Lead Free; Case/Package: 0805; REACH SVHC: No SVHC; RoHS: Compliant; Number of Pins: 2; Min Operating Temperature: -55°C; Packaging: Cut Tape (CT); Max Operating Temperature: 155°C; Lifecycle Status: Production; Military Standard: Not; Contact Plating: Tin; Mount: Surface Mount; Voltage Rating: 150V; Schedule B: 8533210045, 8533210045; Width: 1.2446mm; Features: Automotive AEC-Q200; Length: 2mm; Termination: SMD/SMT; Case Code (Imperial): 0805; Number of Terminations: 2; Voltage Rating (DC): 150V

## Sheet SPI.SchDoc
size A4
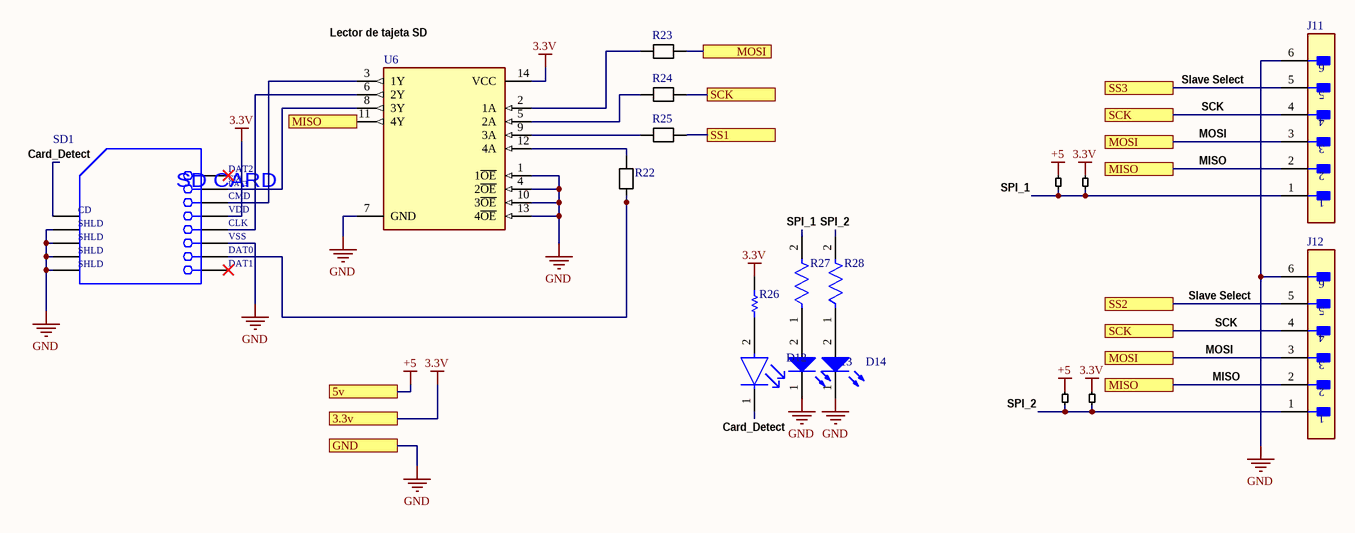
[diagram p3: SPI.SchDoc]

### Parts
D12  LTST-C170KFKT  [FP-LTST-C170KFKT-MFG]  (value not drawn)
D13  150080BS75000  [WL-SMCW_0805_150080xx75000]  (value not drawn)
D14  150080BS75000  [WL-SMCW_0805_150080xx75000]  (value not drawn)
J11  B6B-XH-A(LF)(SN)  [FP-B6B-XH-A_LF_SN-MFG]  (value not drawn)
J12  B6B-XH-A(LF)(SN)  [FP-B6B-XH-A_LF_SN-MFG]  (value not drawn)
R22  3k3  [1206]  (value not drawn)
R23  3k3  [1206]  (value not drawn)
R24  3k3  [1206]  (value not drawn)
R25  3k3  [1206]  (value not drawn)
R26  ERJ6ENF6800V  [RESC2013X70X40ML20T20]  (value not drawn)
R27  ERJ-P06F1001V  [FP-ERJP06-MFG]  (value not drawn)
R28  ERJ-P06F1001V  [FP-ERJP06-MFG]  (value not drawn)
SD1  473521001  [MOLX-473521001_V]  (value not drawn)
U6  SN74LVC125APWR  [FP-PW0014A-IPC_B]  (value not drawn)
W21  Jumper  [Jumper Mid]  (value not drawn)
W22  Jumper  [Jumper Mid]  (value not drawn)
W23  Jumper  [Jumper Mid]  (value not drawn)
W24  Jumper  [Jumper Mid]  (value not drawn)

### Ports
3.3v, 5v, GND, MISO, MOSI, SCK, SS1, SS2, SS3

### Nets
3.3V: R26.2 SD1.4(VDD) U6.14(VCC) W23.2 W24.2 ; port 3.3v
+5: W21.2 W22.2 ; port 5v
GND: D13.1(K) D14.1(K) J11.6 J12.6 SD1.6(VSS) SD1.10(SHLD) SD1.11(SHLD) SD1.12(SHLD) SD1.13(SHLD) U6.1(1~{OE}) U6.4(2~{OE}) U6.7(GND) U6.10(3~{OE}) U6.13(4~{OE}) ; port GND
Card_Detect: D12.1(C) SD1.9(CD)
IO6: J11.5 ; port SS3
IO7: J12.5 ; port SS2
L.S.30: R25.2 ; port SS1
L.S.MISO: J11.2 J12.2 U6.11(4Y) ; port MISO
L.S.MOSI: J11.3 J12.3 R23.2 ; port MOSI
L.S.SCK: J11.4 J12.4 R24.2 ; port SCK
SPI_1: J11.1 R27.2 W21.1 W23.1
SPI_2: J12.1 R28.2 W22.1 W24.1
NetD12_2: D12.2(A) R26.1
NetD13_2: D13.2(A) R27.1
NetD14_2: D14.2(A) R28.1
NetR22_1: R22.1 U6.12(4A)
NetR22_2: R22.2 SD1.7(DAT0)
NetR23_1: R23.1 U6.2(1A)
NetR24_1: R24.1 U6.5(2A)
NetR25_1: R25.1 U6.9(3A)
NetSD1_2: SD1.2(CD/DAT3) U6.8(3Y)
NetSD1_3: SD1.3(CMD) U6.3(1Y)
NetSD1_5: SD1.5(CLK) U6.6(2Y)

Not connected (* = marked no-connect by the designer): SD1 1(DAT2)* 8(DAT1)*

### Notes on the sheet
- (near U6) Lector de tajeta SD
- Slave Select
- SCK
- MOSI
- MISO
- (near J12) Slave Select
- (in symbol CMP-2000-05848-1) CD/; DAT3; SD CARD

### Library data of the parts
D12 = CMP-22017-000036-1: LED ORANGE CLEAR SMD; Forward Current: 30mA; Reverse Voltage: 5V; Forward Voltage: 2V; Lens Style: Diffused; Number of Elements: 1; Test Current: 20mA; Lens Color: Colorless; Viewing Angle: 130°; Dominant Wavelength: 605nm; Luminous Intensity: 60mcd; Power Rating: 75mW; Wavelength: 611nm; Min Operating Temperature: -55°C; Packaging: Tape and Reel; Case Code (Metric): 2012; Depth: 1.6mm; Case Code (Imperial): 0805; Mount: Surface Mount; Radiation Hardening: No; Lens Transparency: Clear; Color: Orange; Package Quantity: 1; Illumination Color: Orange; Lead Free: Lead Free; Number of LEDs: 1; Length: 3.2mm; Height: 1.1mm; Number of Pins: 2; Width: 1.25mm; Case/Package: 0805; Power Dissipation: 75mW; Max Operating Temperature: 85°C
D13 D14 = CMP-1426-00008-6: as D3 on sheet I2C; Min Operating Temperature: -40°C; Mount: Surface Mount; Case Code (Imperial): 0805; Packaging: Tape and Reel; Lead Free: Lead Free; Length: 2mm; Case/Package: 0805; Case Code (Metric): 2012; Max Operating Temperature: 85°C; Height: 700µm; RoHS: Compliant; Max Reverse Voltage (DC): 5V; REACH SVHC: Unknown; Width: 1.25mm; Wavelength: 470nm
J11 J12 = CMP-17439-000076-1: CONN HEADER VERT 6POS 2.5MM
R22-R25 = RGC1206DTC10K0: Package: None; Price: None; Value: *; MP: RGC1206DTC10K0; Availability: Unavailable
R26 = CMP-2001-00566-1: Manufacturer: Panasonic; Part Number: ERJ6ENF6800V
R27 R28 = CMP-05422-000125-1: as R13 on sheet I2C; Case Code (Metric): 2012; Max Operating Temperature: 155°C; REACH SVHC: No SVHC; Mount: Surface Mount; Military Standard: Not; Package Quantity: 5000; Series: ERJ; Height: 0.6mm; Radiation Hardening: No; Termination: Tab; Number of Terminations: 2; Length: 2mm; Resistance Tolerance: 1%; Voltage Rating (DC): 150V; Depth: 1.25mm; Construction: Rectangular; Resistor Type: Thick Film; Packaging: Tape and Reel; Contact Plating: Tin; RoHS Compliant: Yes; Features: Automotive AEC-Q200; Number of Pins: 2; Case Code (Imperial): 0805; Technology: THICK FILM; Width: 1.2mm; Case/Package: 0805; Min Operating Temperature: -55°C; Power Rating: 500mW; Tolerance: 1%
SD1 = CMP-2000-05848-1: MicroSD(TM), Pitch 1.1 mm, 8 Position, Height 1.88 mm, -20 to 85 degC, RoHS, Tape and Reel; Manufacturer: Molex; Datasheet Version: Rev. G, 01/2012; Datasheet URL: http://www.molex.com/pdm_docs/sd/473521001_sd.pdf; Package Reference: 473521001; Manufacturer URL: http://www.molex.com/; Mounting Technology: SurfaceMount; Package Description: MicroSD(TM), Pitch 1.1 mm, 8 Position, Height 1.88 mm
U6 = CMP-0440-00179-4: IC BUF NON-INVERT 3.6V 14TSSOP; Max Power Dissipation: 500mW; Number of Bits per Element: 1; Number of Bits: 4; Quiescent Current: 1uA; Min Supply Voltage: 1.65V; Propagation Delay: 4.6ns; High Level Output Current: -24mA; Logic Function: Buffer; Low Level Output Current: 24mA; Polarity: Non-Inverting; Turn-On Delay Time: 5.3ns; Number of Output Lines: 3; Mount: Surface Mount; Lead Free: Lead Free; Number of Outputs: 4; Max Supply Voltage: 3.6V; Packaging: Tape and Reel; Radiation Hardening: No; Number of Channels: 4; REACH SVHC: No SVHC; Length: 5mm; Number of Elements: 4; Contact Plating: Gold; Case/Package: TSSOP; Number of Input Lines: 4; Number of Inputs: 4; Height: 1.15mm; Number of Circuits: 4; Termination: SMD/SMT; Min Operating Temperature: -40°C; Package Quantity: 1; Number of Gates: 4; Max Operating Temperature: 125°C; Width: 4.4mm; Number of Pins: 14

## Sheet UART.SchDoc
size A4
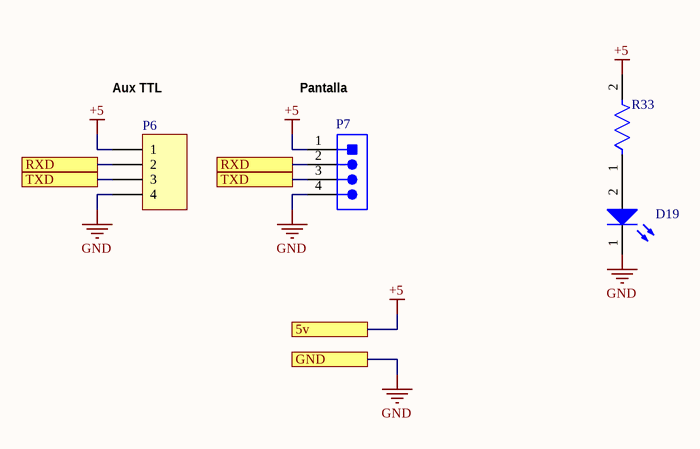
[diagram p4: UART.SchDoc]

### Parts
D19  150080BS75000  [WL-SMCW_0805_150080xx75000]  (value not drawn)
P6  Header 4  [HDR1X4]  (value not drawn)
P7  B4B-PH-K-S(LF)(SN)  [JST-B4B-PH-K-S_V]  (value not drawn)
R33  ERJ-P06F1001V  [FP-ERJP06-IPC_C]  (value not drawn)

### Ports
5v, GND, RXD, TXD

### Nets
+5: P6.1 P7.1 R33.2 ; port 5v
GND: D19.1(K) P6.4 P7.4 ; port GND
L.S.RXD0: P6.2 P7.2 ; port RXD
L.S.TXD0: P6.3 P7.3 ; port TXD
NetD19_2: D19.2(A) R33.1

### Notes on the sheet
- (near P6) Aux TTL
- (near P7) Pantalla

### Library data of the parts
D19 = CMP-1426-00008-6: as D3 on sheet I2C; Min Operating Temperature: -40°C; Mount: Surface Mount; Case Code (Imperial): 0805; Packaging: Tape and Reel; Lead Free: Lead Free; Length: 2mm; Case/Package: 0805; Case Code (Metric): 2012; Max Operating Temperature: 85°C; Height: 700µm; RoHS: Compliant; Max Reverse Voltage (DC): 5V; REACH SVHC: Unknown; Width: 1.25mm; Wavelength: 470nm
P6 = Header 4: Header, 4-Pin; LatestRevisionDate: 17-Jul-2002; LatestRevisionNote: Re-released for DXP Platform.; Publisher: Altium Limited
P7 = CMP-2000-05165-1: Male Header, Pitch 2 mm, 1 x 4 Position, Height 6 mm, Tail Length 3.4 mm, -25 to 85 degC, RoHS, Bulk; Manufacturer: JST; No of Positions: 4; Style/Orientation: StraightHeader/Plug; Pitch: 2mm; Datasheet URL: http://datasheet.octopart.com/B4B-PH-K-S%28LF%29%28SN%29-JST-datasheet-10558886.pdf; Type: ShroudedHeader; Manufacturer URL: http://www.jst.com/home2.html; Termination: Crimp; Datasheet Version: Apr-09
R33 = CMP-05422-000125-1: as R13 on sheet I2C; Case Code (Metric): 2012; Max Operating Temperature: 155°C; REACH SVHC: No SVHC; Mount: Surface Mount; Military Standard: Not; Package Quantity: 5000; Series: ERJ; Height: 0.6mm; Radiation Hardening: No; Termination: Tab; Number of Terminations: 2; Length: 2mm; Resistance Tolerance: 1%; Voltage Rating (DC): 150V; Depth: 1.25mm; Construction: Rectangular; Resistor Type: Thick Film; Packaging: Tape and Reel; Contact Plating: Tin; RoHS Compliant: Yes; Features: Automotive AEC-Q200; Number of Pins: 2; Case Code (Imperial): 0805; Technology: THICK FILM; Width: 1.2mm; Case/Package: 0805; Min Operating Temperature: -55°C; Power Rating: 500mW; Tolerance: 1%

## Sheet High_Power.SchDoc
size A4
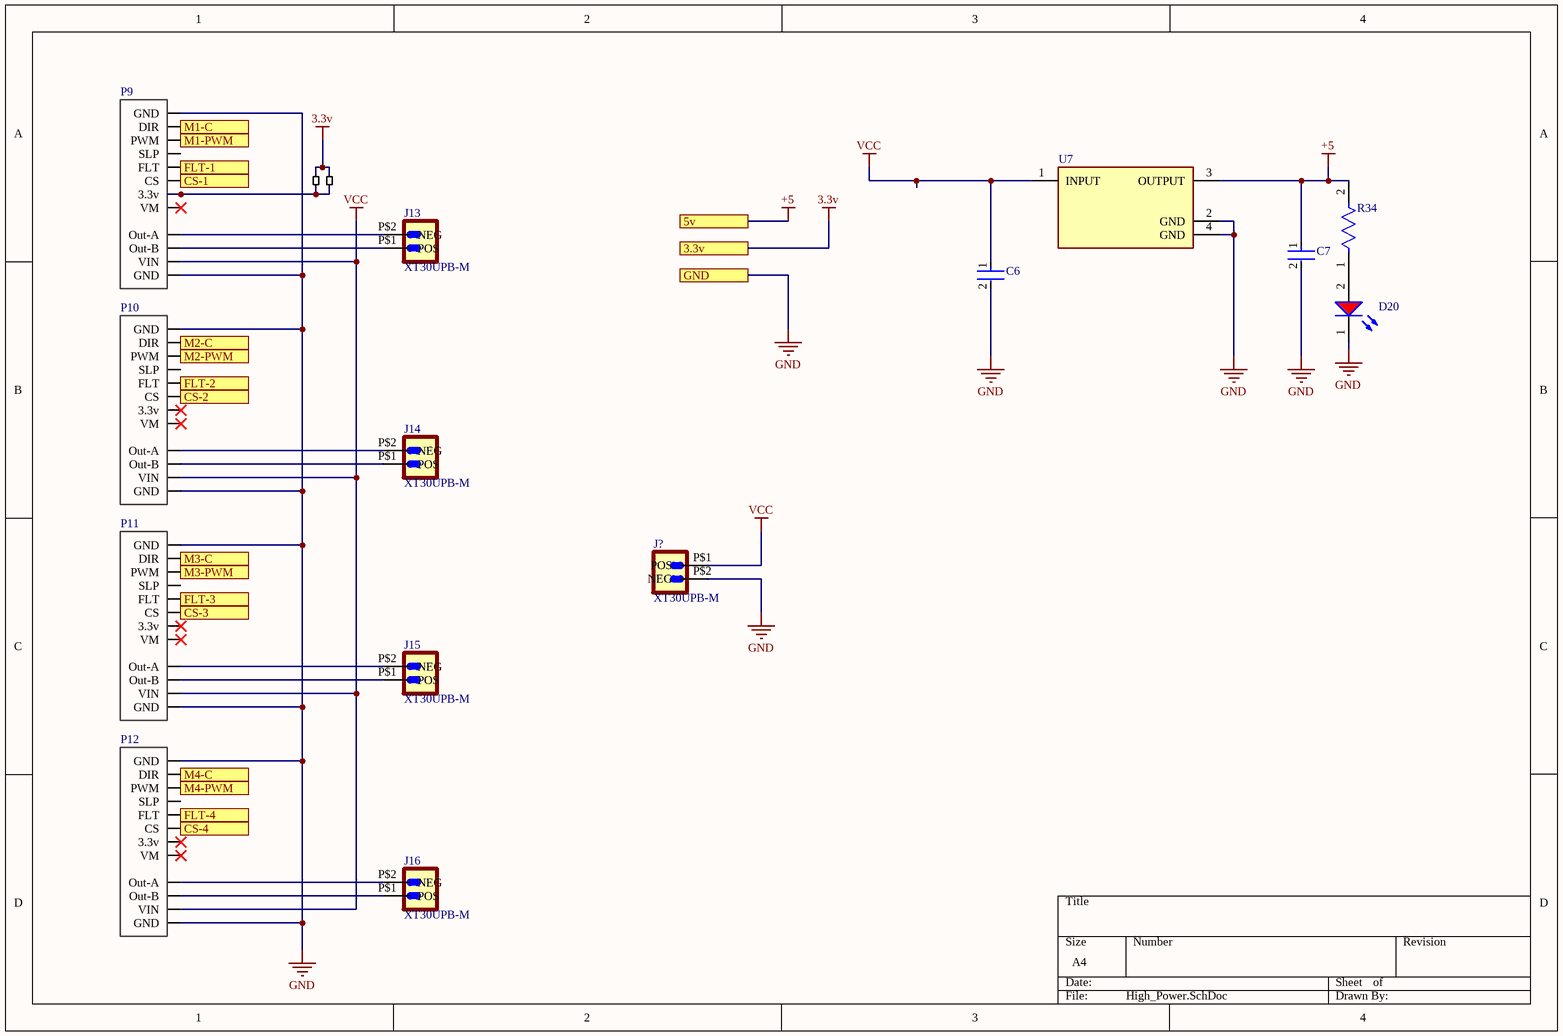
[diagram p5: High_Power.SchDoc]

### Parts
C6  GRM31CR71A226KE15L  [FP-GRM31C-0_2-e0_3_0_8-MFG]  (value not drawn)
C7  GRM31CR71A226KE15L  [FP-GRM31C-0_2-e0_3_0_8-MFG]  (value not drawn)
D20  150080SS75000  [WL-SMCW_0805_150080xx75000]  (value not drawn)
J13  XT30UPB-M  [XT30UPB-M]
J14  XT30UPB-M  [XT30UPB-M]
J15  XT30UPB-M  [XT30UPB-M]
J16  XT30UPB-M  [XT30UPB-M]
J?  XT30UPB-M  [XT30UPB-M]
P9  Pololu G2 High-Power Motor Driver 18v25  [Pololu G2 High-Power Motor Driver 18v25]  (value not drawn)
P10  Pololu G2 High-Power Motor Driver 18v25  [Pololu G2 High-Power Motor Driver 18v25]  (value not drawn)
P11  Pololu G2 High-Power Motor Driver 18v25  [Pololu G2 High-Power Motor Driver 18v25]  (value not drawn)
P12  Pololu G2 High-Power Motor Driver 18v25  [Pololu G2 High-Power Motor Driver 18v25]  (value not drawn)
R34  CRCW080510K0FKEA  [FP-CRCW0805-e3-IPC_A]  (value not drawn)
U7  LM7805MP/NOPB  [FP-DCY0004A-MFG]  (value not drawn)
W25  Jumper  [Jumper Mid]  (value not drawn)
W26  Jumper  [Jumper Mid]  (value not drawn)

### Ports
3.3v, 5v, CS-1, CS-2, CS-3, CS-4, FLT-1, FLT-2, FLT-3, FLT-4, GND, M1-C, M1-PWM, M2-C, M2-PWM, M3-C, M3-PWM, M4-C, M4-PWM

### Nets
3.3V: W25.2 W26.2 ; port 3.3v
+5: C7.1 R34.2 U7.3(OUTPUT) ; port 5v
GND: C6.2 C7.2 D20.1(K) J?.P$2(NEG) P9.1(GND) P9.12(GND) P10.1(GND) P10.12(GND) P11.1(GND) P11.12(GND) P12.1(GND) P12.12(GND) U7.2(GND) U7.4(GND) ; port GND
VCC: C6.1 J?.P$1(POS) P9.11(VIN) P10.11(VIN) P11.11(VIN) P12.11(VIN) U7.1(INPUT)
17: P9.3(PWM) ; port M1-PWM
18: P9.2(DIR) ; port M1-C
23: P10.2(DIR) ; port M2-C
24: P10.3(PWM) ; port M2-PWM
25: P11.2(DIR) ; port M3-C
26: P11.3(PWM) ; port M3-PWM
31: P12.2(DIR) ; port M4-C
32: P12.3(PWM) ; port M4-PWM
I.AIN0: P9.6(CS) ; port CS-1
I.AIN1: P10.6(CS) ; port CS-2
I.AIN2: P11.6(CS) ; port CS-3
I.AIN3: P12.6(CS) ; port CS-4
IO8: P10.5(FLT) ; port FLT-2
IO9: P9.5(FLT) ; port FLT-1
IO10: P11.5(FLT) ; port FLT-3
IO11: P12.5(FLT) ; port FLT-4
NetD20_2: D20.2(A) R34.1
NetJ13_P$1: J13.P$1(POS) P9.10(Out-B)
NetJ13_P$2: J13.P$2(NEG) P9.9(Out-A)
NetJ14_P$1: J14.P$1(POS) P10.10(Out-B)
NetJ14_P$2: J14.P$2(NEG) P10.9(Out-A)
NetJ15_P$1: J15.P$1(POS) P11.10(Out-B)
NetJ15_P$2: J15.P$2(NEG) P11.9(Out-A)
NetJ16_P$1: J16.P$1(POS) P12.10(Out-B)
NetJ16_P$2: J16.P$2(NEG) P12.9(Out-A)
NetP9_7: P9.7(3.3v) W25.1 W26.1

Not connected (* = marked no-connect by the designer): P9 4(SLP) 8(VM)*; P10 4(SLP) 7(3.3v)* 8(VM)*; P11 4(SLP) 7(3.3v)* 8(VM)*; P12 4(SLP) 7(3.3v)* 8(VM)*

### Library data of the parts
C6 C7 = CMP-06035-003841-1: Chip Multilayer Ceramic Capacitors for General Purpose, 1206, 22uF, X7R, 15%, 10%, 10V; Height: 1.6mm; Width: 0.063inch; Min Operating Temperature: -55°C; Package Quantity: 1; Termination: SMD/SMT; Length: 3.2mm; Voltage Rating: 10V; Case/Package: 1206; Capacitance: 22uF; Case Code (Imperial): 1206; Depth: 1.6mm; Dielectric: X7R; Voltage: 10V; Material: Ceramic; Tolerance: 10%; Voltage Rating (DC): 10V; Lead Free: Lead Free; Max Operating Temperature: 125°C; Case Code (Metric): 3216; Packaging: Tape and Reel; Thickness: 0.071inch; Radiation Hardening: No; REACH SVHC: No SVHC; Mount: Surface Mount
D20 = CMP-1426-00010-3: NexarPartId: 29717782; Peak Wavelength: 645nm; Luminous Intensity: 60mcd; Max Junction Temperature (Tj): 95°C; Wavelength: 630nm; Forward Current: 100mA; Max Reverse Voltage (DC): 5V; Color: Red; Lens Style: Clear, Rectangular; Test Current: 20mA; Power Dissipation: 72mW; Viewing Angle: 140°; Forward Voltage: 1.9V; Case Code (Metric): 2012; Max Operating Temperature: 85°C; Mount: Surface Mount; Height: 700µm; Case/Package: 0805; Min Operating Temperature: -40°C; Reverse Voltage: 5V; RoHS: Compliant; Packaging: Tape and Reel; REACH SVHC: Unknown; Case Code (Imperial): 0805; Length: 2mm; Width: 1.25mm; Dominant Wavelength: 630nm
J13-J16 J? = XT30UPB-M: Socket; DC supply; XT30; male; PIN: 2; on PCBs; THT; yellow; 15A; 500V; MF: amass; MP: XT30UPB-M; Value: *; SnapEDA_Link: https://www.snapeda.com/parts/XT30UPB-M/AMASS/view-part/?ref=snap; Price: None; Package: None; Check_prices: https://www.snapeda.com/parts/XT30UPB-M/AMASS/view-part/?ref=eda; Availability: Not in stock
R34 = CMP-2001-04908-2: as R1 on sheet Hoja_principal_Sumo_2024; Weight: 0.000194oz; Package Quantity: 5000; Military Standard: Not; Max Operating Temperature: 155°C; Temperature Coefficient: 100ppm/°C; Contact Plating: Tin; Width: 1.25mm; Height: 0.45mm; Radiation Hardening: No; Tolerance: 1%; Min Operating Temperature: -55°C; Voltage Rating: 150V; Length: 2mm; Depth: 1.25mm; Termination: SMD/SMT; Packaging: Tape and Reel; Case/Package: 0805; Case Code (Metric): 2012; Lead Free: Lead Free; Case Code (Imperial): 0805; Composition: Thick Film
U7 = CMP-04917-000007-1: IC REG LINEAR 5V 1.5A SOT223-4; Manufacturer: Texas Instruments; Max Supply Voltage: 30V; Max Junction Temp: +150°C; Number Of Outputs: 1; Standoff Height: 0.02mm; Dropout Voltage: 2V; Accuracy Percentage: 3%; Nominal Supply Current: 8mA; Output Type: Fixed; Min Supply Voltage: 7.5V; Lead Free: Yes; Device Class L1: Integrated Circuits (ICs); Manufacturer Part Number: LM7805MP/NOPB; Package: DCY0004A; ComponentLink2Description: Datasheet; Temperature Range Low: 0°C; ComponentLink2URL: http://www.ti.com/lit/ds/symlink/lm7800.pdf; Height: 1.8mm; Temperature: 0°C to +125°C; Category: IC; Device Class L3: Voltage Regulators - Linear; Octopart: https://octopart.com/lm7805mp%2Fnopb-texas+instruments-74629991; Device Class L2: Power Management ICs; Output Voltage: 5V; RoHS: TRUE; Temperature Range High: +125°C; Automotive: No; Digikey Description: IC REG LINEAR 5V 1.5A SOT223-4; Output Current: 1.5A

## Nets that join several sheets
3.3V: Hoja_principal_Sumo_2024 (12 pins), I2C (W15.2 W16.2 W17.2), QTR (8 pins), SPI (5 pins), High_Power (W25.2 W26.2)
+5: Hoja_principal_Sumo_2024 (20 pins), I2C (9 pins), SPI (W21.2 W22.2), UART (P6.1 P7.1 R33.2), High_Power (C7.1 R34.2 U7.3)
GND: Hoja_principal_Sumo_2024 (34 pins), I2C (18 pins), QTR (8 pins), SPI (14 pins), UART (D19.1 P6.4 P7.4), High_Power (14 pins)
4: Hoja_principal_Sumo_2024 (U3.4), QTR (P2.3)
5: Hoja_principal_Sumo_2024 (U3.5), QTR (P3.3)
17: Hoja_principal_Sumo_2024 (U3.17), High_Power (P9.3)
18: Hoja_principal_Sumo_2024 (U3.18), High_Power (P9.2)
23: Hoja_principal_Sumo_2024 (U3.23), High_Power (P10.2)
24: Hoja_principal_Sumo_2024 (U3.24), High_Power (P10.3)
25: Hoja_principal_Sumo_2024 (U3.25), High_Power (P11.2)
26: Hoja_principal_Sumo_2024 (U3.26), High_Power (P11.3)
31: Hoja_principal_Sumo_2024 (U3.31), High_Power (P12.2)
32: Hoja_principal_Sumo_2024 (U3.32), High_Power (P12.3)
38: Hoja_principal_Sumo_2024 (U3.38), QTR (P4.3)
39: Hoja_principal_Sumo_2024 (U3.39), QTR (P5.3)
I.AIN0: Hoja_principal_Sumo_2024 (U2.5), High_Power (P9.6)
I.AIN1: Hoja_principal_Sumo_2024 (U2.4), High_Power (P10.6)
I.AIN2: Hoja_principal_Sumo_2024 (U2.7), High_Power (P11.6)
I.AIN3: Hoja_principal_Sumo_2024 (U2.6), High_Power (P12.6)
IO0: Hoja_principal_Sumo_2024 (U1.21), I2C (J5.5 R16.2)
IO1: Hoja_principal_Sumo_2024 (U1.22), I2C (J8.5 R19.2)
IO2: Hoja_principal_Sumo_2024 (U1.23), I2C (J6.5 R17.2)
IO3: Hoja_principal_Sumo_2024 (U1.24), I2C (J7.5 R18.2)
IO4: Hoja_principal_Sumo_2024 (U1.25), I2C (J9.5 R20.2)
IO5: Hoja_principal_Sumo_2024 (U1.26), I2C (J10.5 R21.2)
IO6: Hoja_principal_Sumo_2024 (U1.27), SPI (J11.5)
IO7: Hoja_principal_Sumo_2024 (U1.28), SPI (J12.5)
IO8: Hoja_principal_Sumo_2024 (U1.1), High_Power (P10.5)
IO9: Hoja_principal_Sumo_2024 (U1.2), High_Power (P9.5)
IO10: Hoja_principal_Sumo_2024 (U1.3), High_Power (P11.5)
IO11: Hoja_principal_Sumo_2024 (U1.4), High_Power (P12.5)
L.S.28: Hoja_principal_Sumo_2024 (R3.1 U1.12 U2.10 U4.9), I2C (9 pins)
L.S.29: Hoja_principal_Sumo_2024 (R4.1 U1.13 U2.9 U4.8), I2C (9 pins)
L.S.30: Hoja_principal_Sumo_2024 (U4.7), SPI (R25.2)
L.S.MISO: Hoja_principal_Sumo_2024 (U4.4), SPI (J11.2 J12.2 U6.11)
L.S.MOSI: Hoja_principal_Sumo_2024 (U4.5), SPI (J11.3 J12.3 R23.2)
L.S.RXD0: Hoja_principal_Sumo_2024 (U4.3), UART (P6.2 P7.2)
L.S.SCK: Hoja_principal_Sumo_2024 (U4.6), SPI (J11.4 J12.4 R24.2)
L.S.TXD0: Hoja_principal_Sumo_2024 (U4.1), UART (P6.3 P7.3)